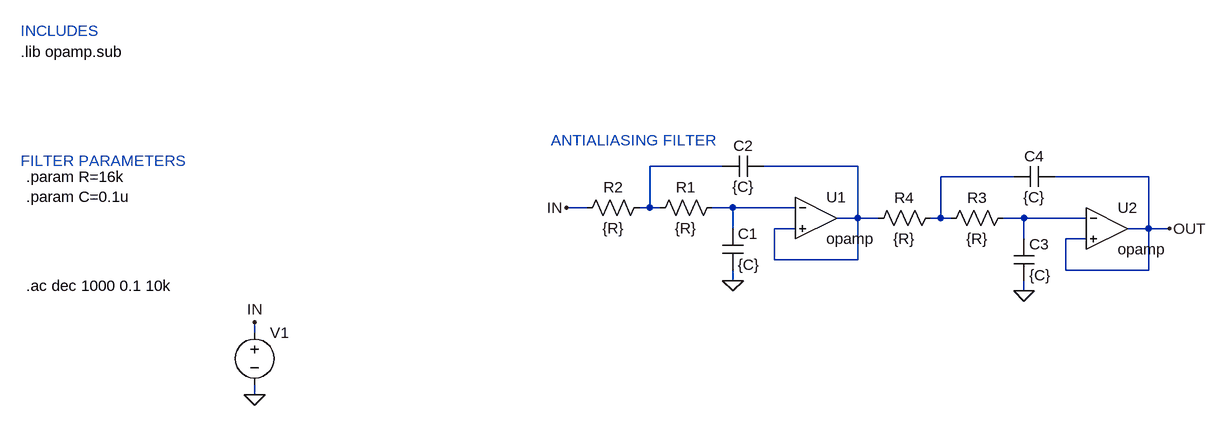
[diagram p0: schematic lowpass-4th-order.asc]
lowpass-4th-order.asc, the LTspice schematic file:
Version 4
SHEET 1 2228 680
WIRE 1472 208 1360 208
WIRE 1680 208 1536 208
WIRE 1920 224 1808 224
WIRE 2128 224 1984 224
WIRE 1264 272 1232 272
WIRE 1360 272 1360 208
WIRE 1360 272 1344 272
WIRE 1376 272 1360 272
WIRE 1488 272 1456 272
WIRE 1584 272 1488 272
WIRE 1680 288 1680 208
WIRE 1680 288 1648 288
WIRE 1712 288 1680 288
WIRE 1808 288 1808 224
WIRE 1808 288 1792 288
WIRE 1824 288 1808 288
WIRE 1936 288 1904 288
WIRE 2032 288 1936 288
WIRE 1488 304 1488 272
WIRE 1584 304 1552 304
WIRE 2128 304 2128 224
WIRE 2128 304 2096 304
WIRE 2160 304 2128 304
WIRE 1936 320 1936 288
WIRE 2032 320 2000 320
WIRE 1552 352 1552 304
WIRE 1680 352 1680 288
WIRE 1680 352 1552 352
WIRE 2000 368 2000 320
WIRE 2128 368 2128 304
WIRE 2128 368 2000 368
WIRE 1488 384 1488 368
WIRE 1936 400 1936 384
WIRE 752 464 752 448
WIRE 752 560 752 544
FLAG 752 448 IN
FLAG 752 560 0
FLAG 1488 384 0
FLAG 1232 272 IN
FLAG 2160 304 OUT
FLAG 1936 400 0
SYMBOL voltage 752 448 R0
WINDOW 39 0 0 Left 0
SYMATTR InstName V1
SYMATTR Value ""
SYMATTR Value2 AC 1
SYMBOL res 1472 256 R90
WINDOW 0 0 56 VBottom 2
WINDOW 3 32 56 VTop 2
SYMATTR InstName R1
SYMATTR Value {R}
SYMBOL res 1360 256 R90
WINDOW 0 0 56 VBottom 2
WINDOW 3 32 56 VTop 2
SYMATTR InstName R2
SYMATTR Value {R}
SYMBOL cap 1472 304 R0
SYMATTR InstName C1
SYMATTR Value {C}
SYMBOL cap 1536 192 R90
WINDOW 0 0 32 VBottom 2
WINDOW 3 32 32 VTop 2
SYMATTR InstName C2
SYMATTR Value {C}
SYMBOL Opamps\\opamp 1616 224 R0
SYMATTR InstName U1
SYMBOL res 1920 272 R90
WINDOW 0 0 56 VBottom 2
WINDOW 3 32 56 VTop 2
SYMATTR InstName R3
SYMATTR Value {R}
SYMBOL res 1808 272 R90
WINDOW 0 0 56 VBottom 2
WINDOW 3 32 56 VTop 2
SYMATTR InstName R4
SYMATTR Value {R}
SYMBOL cap 1920 320 R0
SYMATTR InstName C3
SYMATTR Value {C}
SYMBOL cap 1984 208 R90
WINDOW 0 0 32 VBottom 2
WINDOW 3 32 32 VTop 2
SYMATTR InstName C4
SYMATTR Value {C}
SYMBOL Opamps\\opamp 2064 240 R0
SYMATTR InstName U2
TEXT 400 392 Left 2 !.ac dec 1000 0.1 10k
TEXT 392 32 Left 2 !.lib opamp.sub
TEXT 392 0 Left 2 ;INCLUDES
TEXT 1208 168 Left 2 ;ANTIALIASING FILTER
TEXT 392 200 Left 2 ;FILTER PARAMETERS
TEXT 400 224 Left 2 !.param R=16k\n.param C=0.1u

The netlist it stands for:
* lowpass-4th-order.asc
V1 IN 0 AC 1
R1 N004 N001 {R}
R2 N001 IN {R}
C1 N004 0 {C}
C2 N002 N001 {C}
XU1 N004 N002 N002 opamp Aol=100K GBW=10Meg  ; pins invin noninvin out
R3 N005 N003 {R}
R4 N003 N002 {R}
C3 N005 0 {C}
C4 OUT N003 {C}
XU2 N005 OUT OUT opamp Aol=100K GBW=10Meg  ; pins invin noninvin out
.ac dec 1000 0.1 10k
.lib opamp.sub
* INCLUDES
* ANTIALIASING FILTER
* FILTER PARAMETERS
.param R=16k
.param C=0.1u
.backanno
.end